# Altium schematic sheet [03] - POWER.SchDoc
size A3; DocumentNumber: 3; SheetNumber: 3; SheetTotal: 9
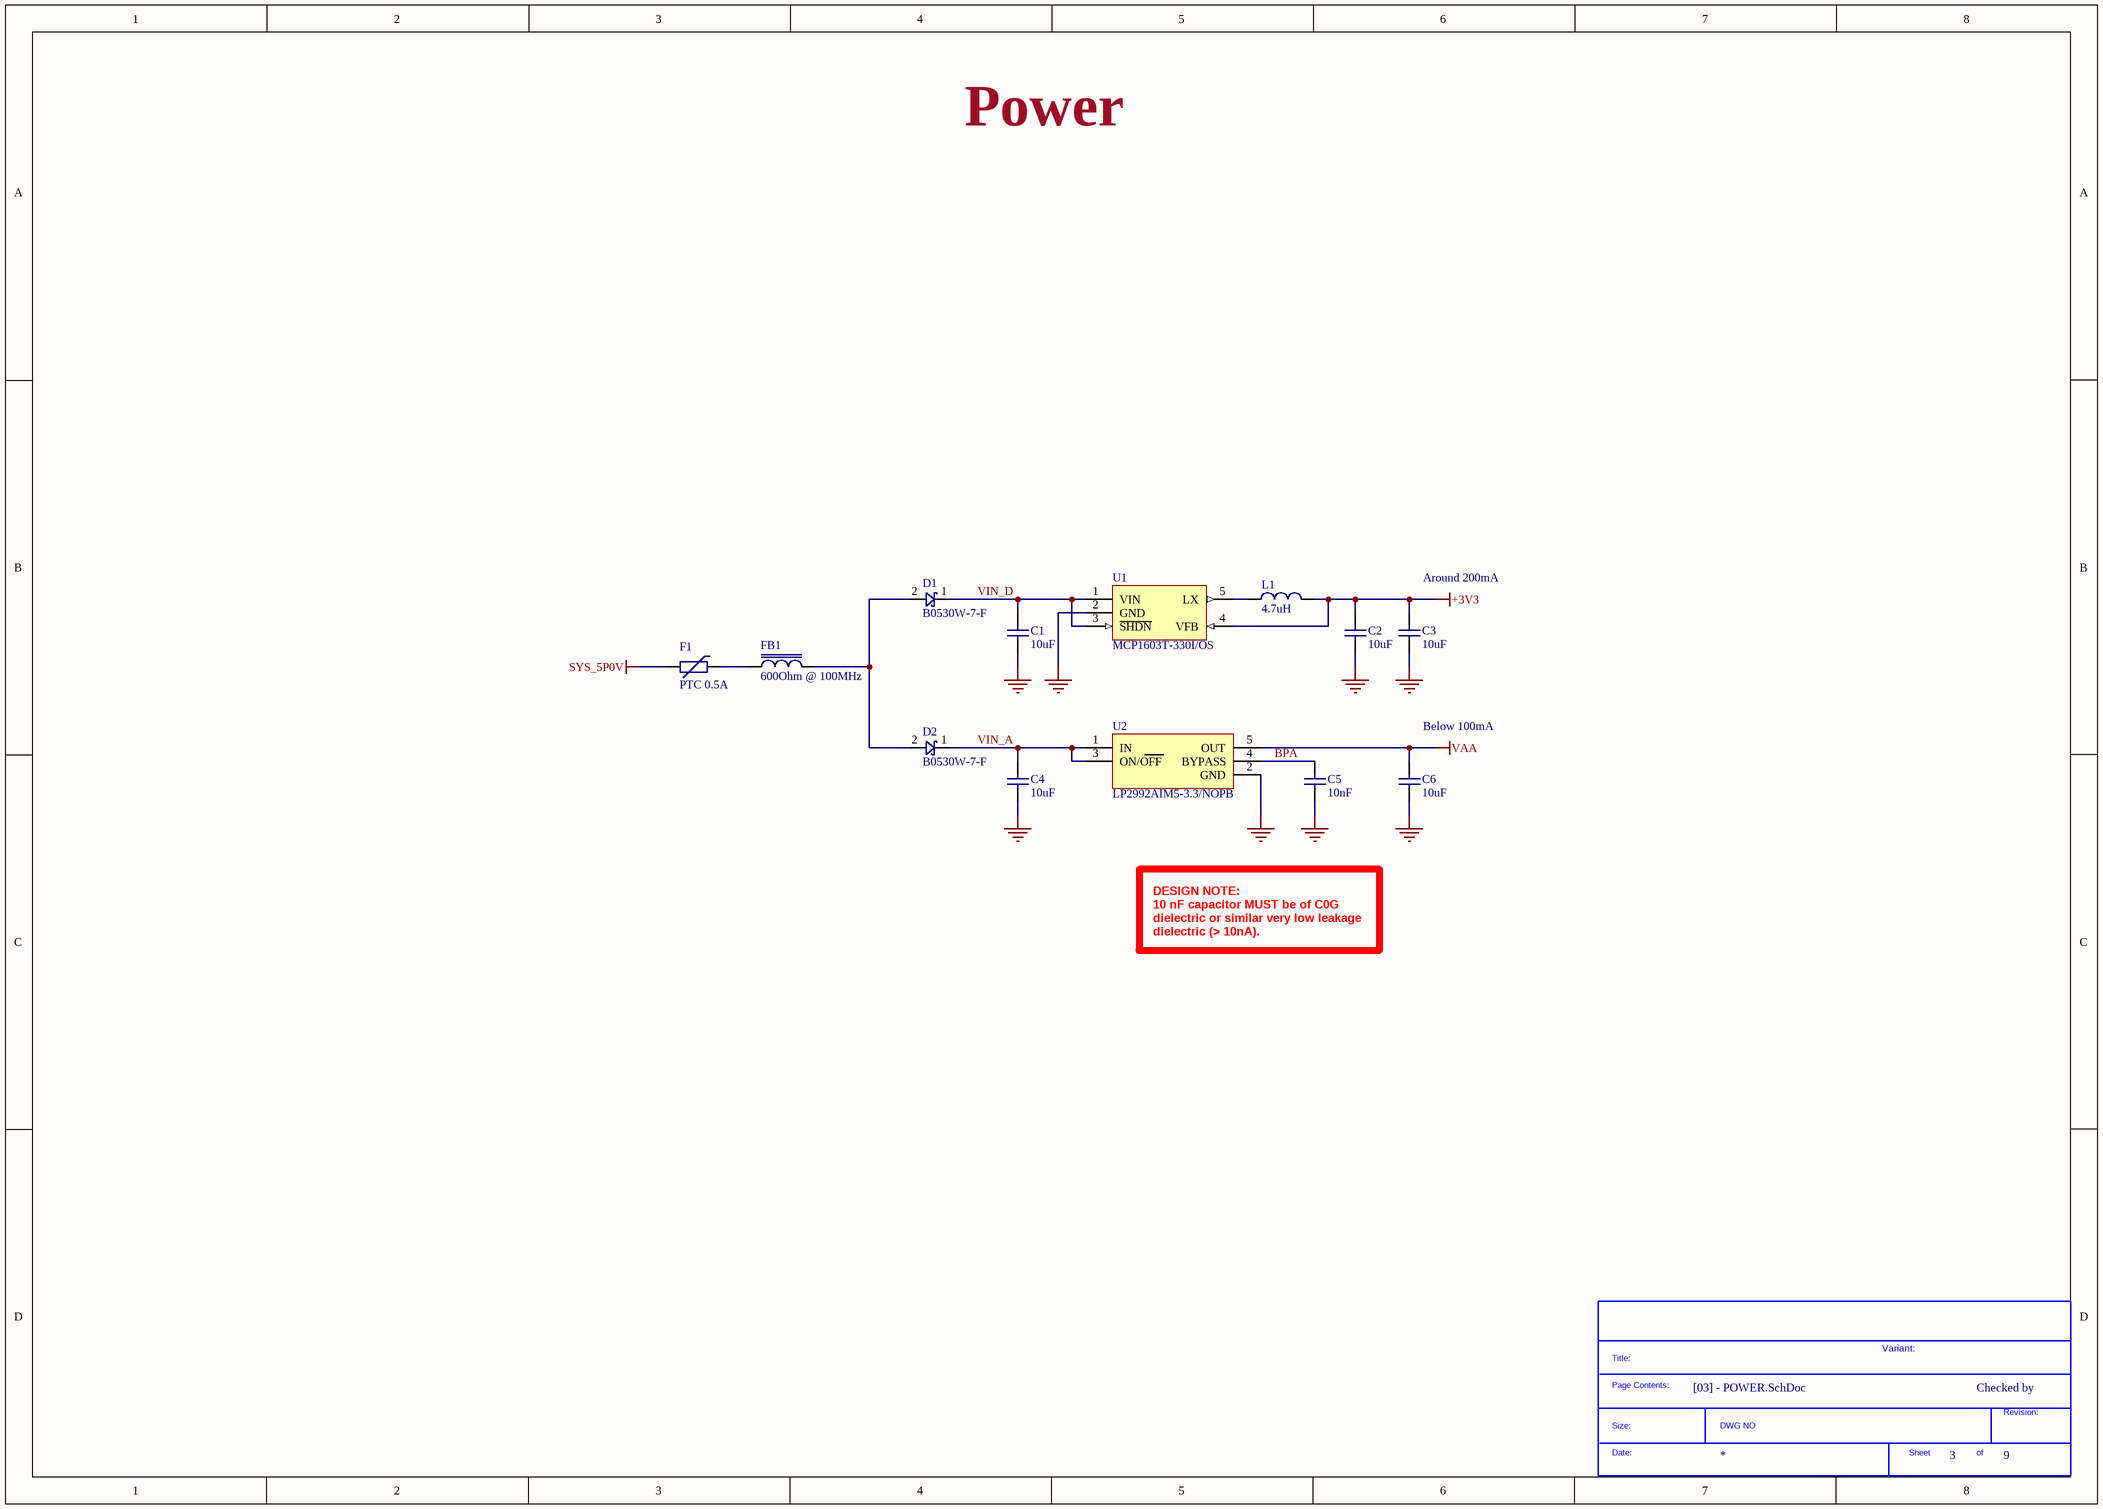
[diagram p0: [03] - POWER.SchDoc]

## Parts
*  SDTitleBlock  (value not drawn)  (graphical)
C1  10uF  [C0603L]
C2  10uF  [C0603L]
C3  10uF  [C0603L]
C4  10uF  [C0603L]
C5  10nF  [C0603L]
C6  10uF  [C0603L]
D1  B0530W-7-F  [SOD123_DIODE]
D2  B0530W-7-F  [SOD123_DIODE]
F1  PTC 0.5A  [FUSE_1812]
FB1  600Ohm @ 100MHz  [R0603L]
L1  4.7uH  [L_SRN3015]
U1  MCP1603T-330I/OS  [SOT23-5N]
U2  LP2992AIM5-3.3/NOPB  [SOT23-5N]

## Nets
+3V3: C2.1 C3.1 L1.2 U1.4(VFB)
GND: C1.2 C2.2 C3.2 C4.2 C5.2 C6.2 U1.2(GND) U2.2(GND)
SYS_5P0V: F1.1
VAA: C6.1 U2.5(OUT)
BPA: C5.1 U2.4(BYPASS)
VIN_A: C4.1 D2.1 U2.1(IN) U2.3(ON/OFF)
VIN_D: C1.1 D1.1 U1.1(VIN) U1.3(~{SHDN})
NetD1_2: D1.2 D2.2 FB1.2
NetF1_2: F1.2 FB1.1
NetL1_1: L1.1 U1.5(LX)

## Notes on the sheet
- Power
- (near C3) Around 200mA
- (near C6) Below 100mA
- DESIGN NOTE:
  10 nF capacitor MUST be of C0G dielectric or similar very low leakage dielectric (> 10nA).
- CLOCKS (CPU & PCIE)
- Variant:
- Checked by
- (in symbol SDTitleBlock) Title:; Page Contents:; Revision:; Size:; DWG NO; Date:; Sheet; of

## Library data of the parts
C1-C4 C6 = GRM188R61C106MA73D: CAP CER 10UF 16V 20% X5R 0603; Manufacturer: Murata Electronics North America; Capacitance: 10µF; Supplier 1: Digi-Key; Manufacturer Part Number: GRM188R61C106MA73D; RoHS: RoHS Compliant; Category: Capacitors; Stock 1: 1868; Pricing 1: 1=0.18, 10=0.171, 25=0.146, 50=0.1242, 100=0.1195, 250=0.10728, 500=0.10238, 1000=0.08532 (EUR); Packaging: Cut Tape (CT); Tolerance: ±20%; Voltage - Rated: 16V; Temperature Coefficient: X5R; Mounting Type: Surface Mount, MLCC; Operating Temperature: -55°C ~ 85°C; Applications: General Purpose; Ratings: -; Package / Case: 0603 (1608 Metric); Size / Dimension: 0.063" L x 0.031" W (1.60mm x 0.80mm); Height - Seated (Max): -; Thickness (Max): 0.031" (0.80mm); Lead Spacing: -; Features: -; Lead Style: -; ComponentLink1URL: http://www.murata.com/~/media/webrenewal/support/library/catalog/products/capacitor/mlcc/c02e.ashx; ComponentLink1Description: http://www.murata.com/~/media/webrenewal/support/library/catalog/products/capacitor/mlcc/c02e.ashx; Supplier Part Number 1: 490-7201-1-ND
C5 = C1608C0G1E103J080AA: CAP CER 10000PF 25V 5% C0G 0603; Manufacturer: TDK Corporation; Temperature Coefficient: C0G, NP0; Supplier 1: Digi-Key; Manufacturer Part Number: C1608C0G1E103J080AA; RoHS: RoHS Compliant; Category: Capacitors; Stock 1: 297001; Pricing 1: 1=0.35, 10=0.287, 100=0.1433, 250=0.10748, 500=0.09496, 1000=0.0842 (EUR); Packaging: Cut Tape (CT); Capacitance: 10000pF; Tolerance: ±5%; Voltage - Rated: 25V; Mounting Type: Surface Mount, MLCC; Operating Temperature: -55°C ~ 125°C; Applications: General Purpose; Ratings: -; Package / Case: 0603 (1608 Metric); Size / Dimension: 0.063" L x 0.031" W (1.60mm x 0.80mm); Height - Seated (Max): -; Thickness (Max): 0.037" (0.95mm); Lead Spacing: -; Features: -; Lead Style: -; ComponentLink1URL: http://product.tdk.com/en/catalog/datasheets/mlcc_commercial_general_en.pdf; ComponentLink1Description: http://product.tdk.com/en/catalog/datasheets/mlcc_commercial_general_en.pdf; Supplier Part Number 1: 445-2664-1-ND
D1 D2 = B0530W-7-F: DIODE SCHOTTKY 30V 500MA SOD123; Manufacturer: Diodes Incorporated; Voltage - Forward (Vf) (Max) @ If: 430mV @ 500mA; Speed: Fast Recovery =< 500ns, > 200mA (Io); Current - Reverse Leakage @ Vr: 130µA @ 30V; Capacitance @ Vr, F: 170pF @ 0V, 1MHz; Supplier 1: Digi-Key; Manufacturer Part Number: B0530W-7-F; RoHS: RoHS Compliant; Category: Discrete Semiconductor Products; Stock 1: 43101; Pricing 1: 1=0.31, 10=0.283, 25=0.2036, 100=0.1582, 250=0.09944, 500=0.08474, 1000=0.05774 (EUR); Packaging: Cut Tape (CT); Diode Type: Schottky; Voltage - DC Reverse (Vr) (Max): 30V; Current - Average Rectified (Io): 500mA; Reverse Recovery Time (trr): -; Mounting Type: Surface Mount; Package / Case: SOD-123; Supplier Device Package: SOD-123; Operating Temperature - Junction: -65°C ~ 125°C; ComponentLink1URL: http://www.diodes.com/datasheets/ds30139.pdf; ComponentLink1Description: http://www.diodes.com/datasheets/ds30139.pdf; Supplier Part Number 1: B0530W-FDICT-ND
F1 = 0ZCG0050AF2C: PTC RESETTBLE 0.50A 30V CHIP 181; Manufacturer: Bel Fuse Inc; Current - Max: 100A; Current - Hold (Ih) (Max): 500mA; Current - Trip (It): 1A; R Min/Max: 0.150 ~ 1.000 Ohm; Time to Trip: 0.15s; Supplier 1: Digi-Key; Manufacturer Part Number: 0ZCG0050AF2C; RoHS: RoHS Compliant; Category: Circuit Protection; Stock 1: 12558; Pricing 1: 1=0.12, 10=0.11, 25=0.1016, 100=0.0912, 250=0.08128, 500=0.06772, 1000=0.06417 (EUR); Packaging: Cut Tape (CT); Voltage - Max: 30V; Package / Case: 1812 (4532 Metric), Concave; ComponentLink1URL: http://www.belfuse.com/pdfs/0ZCG.pdf; ComponentLink1Description: http://www.belfuse.com/pdfs/0ZCG.pdf; Supplier Part Number 1: 507-1762-1-ND
FB1 = MPZ1608S601ATA00: FERRITE CHIP BEAD 600 OHM SMD; Manufacturer: TDK Corporation; Current Rating: 1A; DC Resistance (DCR): 150 mOhm Max; Filter Type: Differential Mode - Single; Supplier 1: Digi-Key; Manufacturer Part Number: MPZ1608S601ATA00; RoHS: RoHS Compliant; Category: Filters; Stock 1: 108962; Pricing 1: 1=0.09, 10=0.07, 100=0.0415, 250=0.0302, 500=0.02768, 1000=0.02391 (EUR); Packaging: Cut Tape (CT); Impedance @ Frequency: 600 Ohm @ 100MHz; Package / Case: 0603 (1608 Metric); Mounting Type: Surface Mount; Height (Max): 0.037" (0.95mm); Size / Dimension: 0.063" L x 0.031" W (1.60mm x 0.80mm); ComponentLink1URL: http://product.tdk.com/en/catalog/datasheets/beads_commercial_power_mpz_en.pdf; ComponentLink1Description: http://product.tdk.com/en/catalog/datasheets/beads_commercial_power_mpz_en.pdf; Supplier Part Number 1: 445-2205-1-ND
L1 = SRN3015-4R7M: FIXED IND 4.7UH 1.4A 136 MOHM; Manufacturer: Bourns Inc.; Type: Wirewound; Material - Core: Ferrite; Inductance: 4.7µH; Tolerance: ±20%; Current - Saturation: 1.2A; Shielding: Shielded; DC Resistance (DCR): 136 mOhm Max; Frequency - Self Resonant: 65MHz; Frequency - Test: 1MHz; Supplier 1: Digi-Key; Manufacturer Part Number: SRN3015-4R7M; RoHS: RoHS Compliant; Category: Inductors, Coils, Chokes; Stock 1: 8540; Pricing 1: 1=0.33, 10=0.293, 25=0.2744, 50=0.2378, 100=0.2195, 250=0.20856, 500=0.19026, 1000=0.16099 (EUR); Packaging: Cut Tape (CT); Current Rating: 1.4A; Q @ Freq: -; Operating Temperature: -40°C ~ 125°C; Mounting Type: Surface Mount; Package / Case: Nonstandard; Size / Dimension: 0.118" L x 0.118" W (3.00mm x 3.00mm); Height - Seated (Max): 0.059" (1.50mm); Supplier Device Package: -; ComponentLink1URL: http://www.bourns.com/data/global/pdfs/SRN3015.pdf; ComponentLink1Description: http://www.bourns.com/data/global/pdfs/SRN3015.pdf; Supplier Part Number 1: SRN3015-4R7MCT-ND
U1 = MCP1603T-330I/OS: IC REG BCK 3.3V 0.5A SYNC TSOT23; Manufacturer: Microchip Technology; Function: Step-Down; Output Configuration: Positive; Topology: Buck; Output Type: Fixed; Number of Outputs: 1; Voltage - Input (Min): 2.7V; Voltage - Input (Max): 5.5V; Current - Output: 500mA; Frequency - Switching: 2MHz; Synchronous Rectifier: Yes; Supplier 1: Digi-Key; Manufacturer Part Number: MCP1603T-330I/OS; RoHS: RoHS Compliant; Category: Integrated Circuits (ICs); Stock 1: 3738; Pricing 1: 1=1.08, 10=0.896, 25=0.75, 100=0.6769 (EUR); Packaging: Cut Tape (CT); Voltage - Output (Min/Fixed): 3.3V; Voltage - Output (Max): -; Operating Temperature: -40°C ~ 125°C (TJ); Mounting Type: Surface Mount; Package / Case: SOT-23-5 Thin, TSOT-23-5; Supplier Device Package: TSOT-23-5; ComponentLink1URL: http://www.microchip.com/mymicrochip/filehandler.aspx?ddocname=en530515; ComponentLink1Description: http://www.microchip.com/mymicrochip/filehandler.aspx?ddocname=en530515; Supplier Part Number 1: MCP1603T-330I/OSCT-ND
U2 = LP2992AIM5-3.3/NOPB: IC REG LDO 3.3V 0.25A SOT23-5; Manufacturer: Texas Instruments; Regulator Topology: Positive Fixed; Current - Output: 250mA; Voltage - Dropout (Typical): 0.45V @ 250mA; Number of Regulators: 1; Voltage - Input: Up to 16V; Supplier 1: Digi-Key; Manufacturer Part Number: LP2992AIM5-3.3/NOPB; RoHS: RoHS Compliant; Category: Integrated Circuits (ICs); Stock 1: 25697; Pricing 1: 1=1.26, 10=1.116, 25=1.0084, 50=0.9336, 100=0.8824, 250=0.7524, 500=0.66538 (EUR); Packaging: Cut Tape (CT); Voltage - Output: 3.3V; Current - Limit (Min): -; Operating Temperature: -40°C ~ 125°C; Mounting Type: Surface Mount; Package / Case: SC-74A, SOT-753; Supplier Device Package: SOT-23-5; ComponentLink1URL: http://www.ti.com/lit/ds/symlink/lp2992.pdf; ComponentLink1Description: http://www.ti.com/lit/ds/symlink/lp2992.pdf; Supplier Part Number 1: LP2992AIM5-3.3/NOPBCT-ND